# Altium schematic sheet interfaces.SchDoc
size C
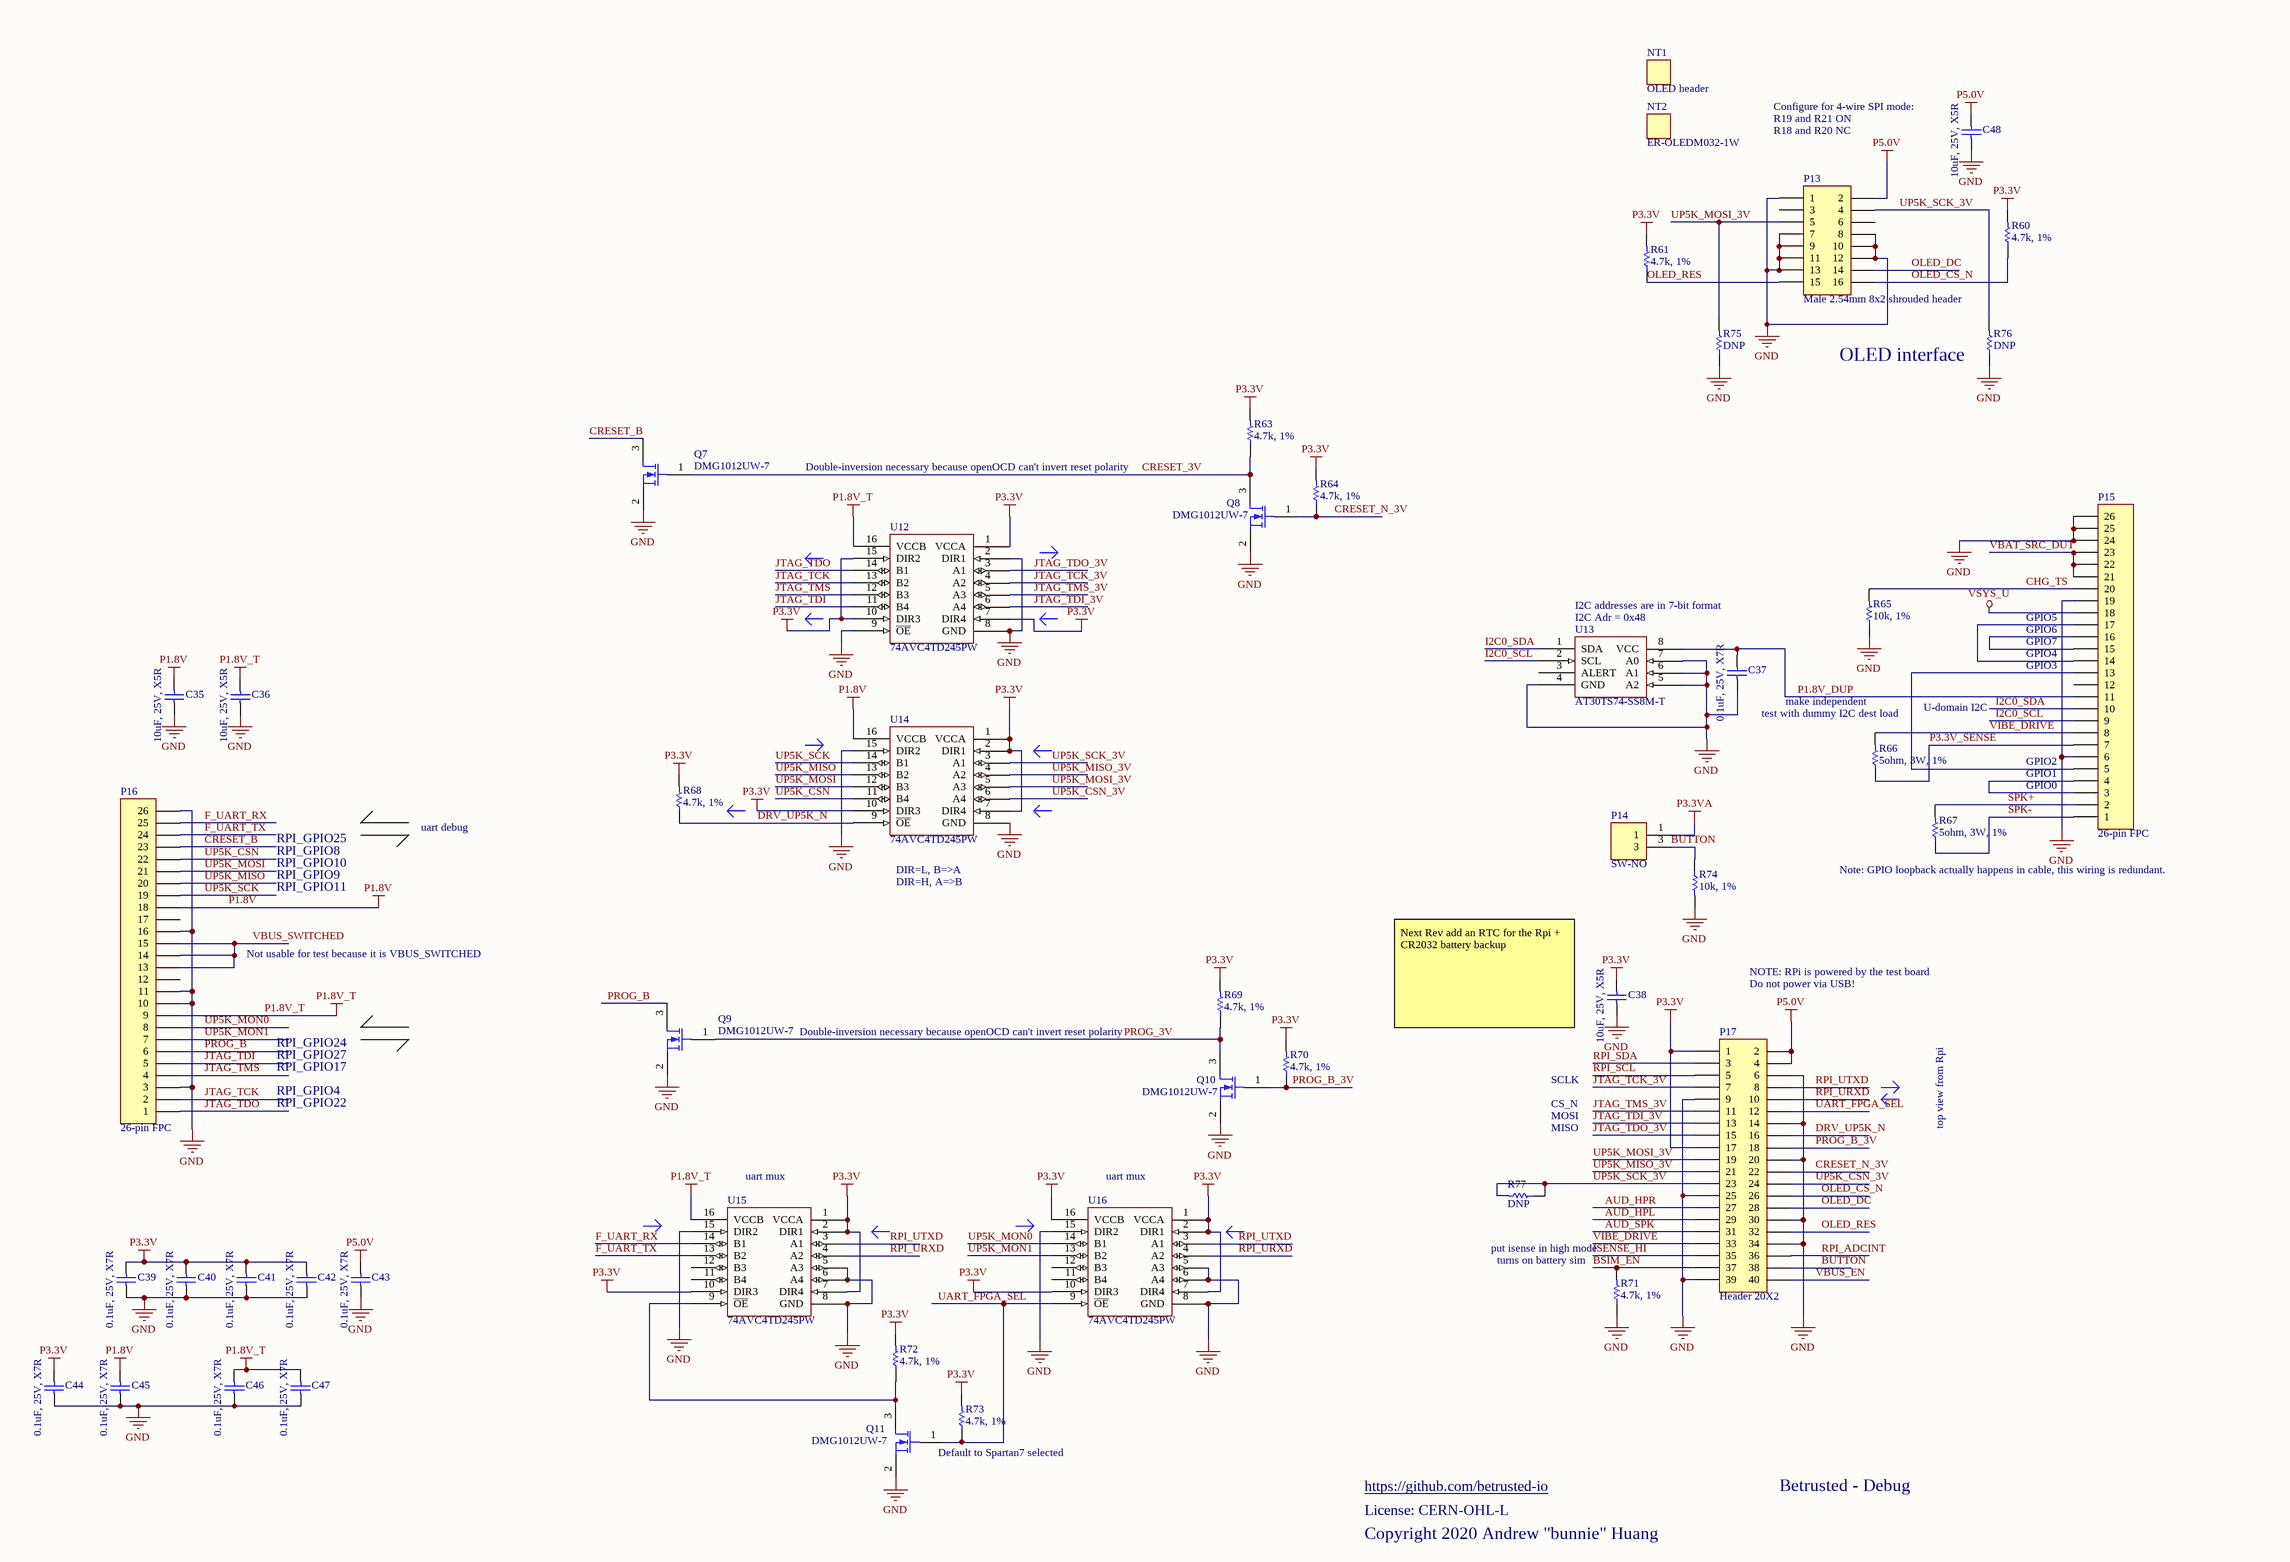
[diagram p0: interfaces.SchDoc]

## Parts
C35  10uF, 25V, X5R  [B_CAP0805]
C36  10uF, 25V, X5R  [B_CAP0805]
C37  0.1uF, 25V, X7R  [B_CAP0603]
C38  10uF, 25V, X5R  [B_CAP0805]
C39  0.1uF, 25V, X7R  [B_CAP0603]
C40  0.1uF, 25V, X7R  [B_CAP0603]
C41  0.1uF, 25V, X7R  [B_CAP0603]
C42  0.1uF, 25V, X7R  [B_CAP0603]
C43  0.1uF, 25V, X7R  [B_CAP0603]
C44  0.1uF, 25V, X7R  [B_CAP0603]
C45  0.1uF, 25V, X7R  [B_CAP0603]
C46  0.1uF, 25V, X7R  [B_CAP0603]
C47  0.1uF, 25V, X7R  [B_CAP0603]
C48  10uF, 25V, X5R  [B_CAP0805]
NT1  OLED header
NT2  ER-OLEDM032-1W
P13  Male 2.54mm 8x2 shrouded header  [ER_OLED_M032_1]
P14  SW-NO  [CK_KS11R22CQD]
P15  26-pin FPC  [HRS_FH34SRJ-26S-0.5SH(50)]
P16  26-pin FPC  [HRS_FH34SRJ-26S-0.5SH(50)]
P17  Header 20X2  [SAMTEC_SSW-120-01-F-D]
Q7  DMG1012UW-7  [SOT323-3AN]
Q8  DMG1012UW-7  [SOT323-3AN]
Q9  DMG1012UW-7  [SOT323-3AN]
Q10  DMG1012UW-7  [SOT323-3AN]
Q11  DMG1012UW-7  [SOT323-3AN]
R60  4.7k, 1%  [B_RES0603]
R61  4.7k, 1%  [B_RES0603]
R63  4.7k, 1%  [B_RES0603]
R64  4.7k, 1%  [B_RES0603]
R65  10k, 1%  [B_RES0603]
R66  5ohm, 3W, 1%  [OHMITE_43_3W]
R67  5ohm, 3W, 1%  [OHMITE_43_3W]
R68  4.7k, 1%  [B_RES0603]
R69  4.7k, 1%  [B_RES0603]
R70  4.7k, 1%  [B_RES0603]
R71  4.7k, 1%  [B_RES0603]
R72  4.7k, 1%  [B_RES0603]
R73  4.7k, 1%  [B_RES0603]
R74  10k, 1%  [B_RES0603]
R75  DNP  [B_RES0603]
R76  DNP  [B_RES0603]
R77  DNP  [B_RES0603]
U12  74AVC4TD245PW  [TSOP65P640-16AN]
U13  AT30TS74-SS8M-T  [SOIC127P600-8AN]
U14  74AVC4TD245PW  [TSOP65P640-16AN]
U15  74AVC4TD245PW  [TSOP65P640-16AN]
U16  74AVC4TD245PW  [TSOP65P640-16AN]

## Nets
GND: C35.2 C36.2 C37.2 C38.2 C39.2 C40.2 C41.2 C42.2 C43.2 C44.2 C45.2 C46.2 C47.2 C48.2 P13.1 P13.7 P13.8 P13.9 P13.10 P13.11 P13.12 P13.13 P15.6 P15.19 P15.24 P15.25 P15.26 P16.3 P16.10 P16.11 P16.16 P16.26 P17.6 P17.9 P17.14 P17.20 P17.25 P17.30 P17.34 P17.39 Q7.2(S) Q8.2(S) Q9.2(S) Q10.2(S) Q11.2(S) R65.1 R71.1 R74.2 R75.1 R76.1 U12.2(DIR1) U12.8(GND) U12.9(~{OE}) U13.4(GND) U13.5(A2) U13.6(A1) U13.7(A0) U14.8(GND) U14.15(DIR2) U15.5(A3) U15.6(A4) U15.8(GND) U15.15(DIR2) U16.5(A3) U16.6(A4) U16.8(GND) U16.15(DIR2)
P1.8V: C35.1 C45.1 P16.18 U14.16(VCCB)
P1.8V_T: C36.1 C46.1 C47.1 P16.9 U12.16(VCCB) U15.16(VCCB)
P3.3V: C38.1 C39.1 C40.1 C41.1 C42.1 C44.1 P17.1 P17.17 R60.2 R61.2 R63.2 R64.2 R68.2 R69.2 R70.2 R72.2 R73.2 U12.1(VCCA) U12.7(DIR4) U12.10(DIR3) U12.15(DIR2) U14.1(VCCA) U14.2(DIR1) U14.7(DIR4) U14.10(DIR3) U15.1(VCCA) U15.2(DIR1) U15.7(DIR4) U15.10(DIR3) U16.1(VCCA) U16.2(DIR1) U16.7(DIR4) U16.10(DIR3) U16.16(VCCB)
P3.3VA: P14.1
P5.0V: C43.1 C48.1 P13.2 P17.2 P17.4
VSYS_U: P15.18
AUD_HPL: P17.29
AUD_HPR: P17.27
AUD_SPK: P17.31
BSIM_EN: P17.37 R71.2
BUTTON: P14.3 P17.38 R74.1
CHG_TS: P15.20 R65.2
CRESET_3V: Q7.1(G) Q8.3(D) R63.1
CRESET_B: P16.23 Q7.3(D)
CRESET_N_3V: P17.22 Q8.1(G) R64.1
DRV_UP5K_N: P17.16 R68.1 U14.9(~{OE})
F_UART_RX: P16.25 U15.14(B1)
F_UART_TX: P16.24 U15.13(B2)
I2C0_SCL: P15.9 U13.2(SCL)
I2C0_SDA: P15.10 U13.1(SDA)
ISENSE_HI: P17.35
JTAG_TCK: P16.2 U12.13(B2)
JTAG_TCK_3V: P17.7 U12.4(A2)
JTAG_TDI: P16.5 U12.11(B4)
JTAG_TDI_3V: P17.13 U12.6(A4)
JTAG_TDO: P16.1 U12.14(B1)
JTAG_TDO_3V: P17.15 U12.3(A1)
JTAG_TMS: P16.4 U12.12(B3)
JTAG_TMS_3V: P17.11 U12.5(A3)
OLED_CS_N: P13.16 P17.26 R60.1
OLED_DC: P13.14 P17.28
OLED_RES: P13.15 P17.32 R61.1
P1.8V_DUP: C37.1 P15.11 U13.8(VCC)
P3.3V_SENSE: P15.7 R66.1
PROG_3V: Q9.1(G) Q10.3(D) R69.1
PROG_B: P16.6 Q9.3(D)
PROG_B_3V: P17.18 Q10.1(G) R70.1
RPI_ADCINT: P17.36
RPI_SCL: P17.5
RPI_SDA: P17.3
RPI_URXD: P17.10 U15.4(A2) U16.4(A2)
RPI_UTXD: P17.8 U15.3(A1) U16.3(A1)
SPK+: P15.2 R67.2
SPK-: P15.1 R67.1
UART_FPGA_SEL: P17.12 Q11.1(G) R73.1 U16.9(~{OE})
UP5K_CSN: P16.22 U14.11(B4)
UP5K_CSN_3V: P17.24 U14.6(A4)
UP5K_MISO: P16.20 U14.13(B2)
UP5K_MISO_3V: P17.21 U14.4(A2)
UP5K_MON0: P16.8 U16.14(B1)
UP5K_MON1: P16.7 U16.13(B2)
UP5K_MOSI: P16.21 U14.12(B3)
UP5K_MOSI_3V: P13.5 P17.19 R75.2 U14.5(A3)
UP5K_SCK: P16.19 U14.14(B1)
UP5K_SCK_3V: P13.4 P17.23 R76.2 R77.1 R77.2 U14.3(A1)
VBAT_SRC_DUT: P15.21 P15.22 P15.23
VBUS_EN: P17.40
VBUS_SWITCHED: P16.13 P16.14 P16.15
VIBE_DRIVE: P15.8 P17.33 R66.2
NetP15_3: P15.3 P15.4
NetP15_5: P15.5 P15.13
NetP15_14: P15.14 P15.17
NetP15_15: P15.15 P15.16
NetQ11_3: Q11.3(D) R72.1 U15.9(~{OE})

Not connected (* = marked no-connect by the designer): P13 3 6; P15 12; P16 12 17; U13 3(ALERT); U15 11(B4) 12(B3); U16 11(B4) 12(B3)

## Notes on the sheet
- (near C48) Configure for 4-wire SPI mode:
- R19 and R21 ON
- R18 and R20 NC
- (near R76) OLED interface
- Double-inversion necessary because openOCD can't invert reset polarity
- I2C addresses are in 7-bit format
- (near U13) I2C Adr = 0x48
- (near P15) GPIO4
- (near P15) GPIO5
- (near P15) GPIO6
- (near P15) GPIO7
- test with dummy I2C dest load
- make independent
- U-domain I2C
- (near P15) GPIO3
- (near P15) GPIO1
- (near P15) GPIO2
- uart debug
- (near P15) GPIO0
- RPI_GPIO10
- RPI_GPIO9
- RPI_GPIO11
- RPI_GPIO8
- RPI_GPIO25
- (near U14) DIR=L, B=>A
- DIR=H, A=>B
- (near R67) Note: GPIO loopback actually happens in cable, this wiring is redundant.
- Not usable for test because it is VBUS_SWITCHED
- (near C38) Next Rev add an RTC for the Rpi + CR2032 battery backup
- NOTE: RPi is powered by the test board
- Do not power via USB!
- RPI_GPIO17
- RPI_GPIO27
- RPI_GPIO24
- RPI_GPIO4
- RPI_GPIO22
- MOSI
- MISO
- SCLK
- CS_N
- top view from Rpi
- (near U15) uart mux
- (near U16) uart mux
- (near R71) put isense in high mode
- (near R71) turns on battery sim
- Default to Spartan7 selected
- https://github.com/betrusted-io
- Betrusted - Debug
- License: CERN-OHL-L
- Copyright 2020 Andrew "bunnie" Huang

## Library data of the parts
C35 C36 C38 C48 = Cap Semi: Capacitor (Semiconductor SIM Model); MPN: GRM21BR61E106KA73L; VENDOR: Murata; MYPN: C-106-25-X5R-0805
C37 C39-C47 = Cap Semi: Capacitor (Semiconductor SIM Model); MPN: CC0603KRX7R8BB104; VENDOR: Murata; MYPN: C-104-25-X7R-0603
NT1 = NOTE: Placeholder for non-board BOM items; MPN: PPPC082LFBN-RC; MYPN: NT-PPPC082LFBN-RC; VENDOR: Sullins
NT2 = NOTE: Placeholder for non-board BOM items; MYPN: NT-ER-OLEDM032-1W; VENDOR: East Rising; MPN: ER-OLEDM032-1W
P13 = Header 8X2: Header, 8-Pin, Dual row, shrouded; MPN: PRPC008DAAN-RC; MYPN: J-2.54MM-2x8-M-SHROUDED-RA; VENDOR: Sullins; LatestRevisionDate: 17-Jul-2002; LatestRevisionNote: Re-released for DXP Platform.; Publisher: Altium Limited
P14 = Header 2: Header, 2-Pin; LatestRevisionDate: 17-Jul-2002; LatestRevisionNote: Re-released for DXP Platform.; Publisher: Altium Limited
P15 = FPC-26: 26 Pin FPC header; MPN: FH34SRJ-26S-0.5SH(99); MYPN: J-FPC-0.5mm-26-0.3mm-T/B; VENDOR: Hirose; System: Connector
P16 = FPC-26: 26 Pin FPC header; MPN: FH34SRJ-26S-0.5SH(99); MYPN: J-FPC-0.5mm-26-0.3mm-T/B; VENDOR: Hirose
P17 = Header 20X2: Header, 20-Pin, Dual row; MPN: P-SSW-120-01-F-D; VENDOR: Samtec; LatestRevisionDate: 17-Jul-2002; LatestRevisionNote: Re-released for DXP Platform.; Publisher: Altium Limited
Q7-Q11 = MOSFET-N: N-Channel MOSFET; VENDOR: Diodes Inc; MYPN: Q-DMG1012UW-7; Published: 8-Jun-2000; LatestRevisionDate: 17-Jul-2002; LatestRevisionNote: Re-released for DXP Platform.; PackageVersion: 1995/1996; PackageReference: E3; Publisher: Altium Limited; MPN: DMG1012UW-7
R60 R61 R63 R64 R68-R73 = Res1: Resistor; MPN: RC0603FR-074K7L; VENDOR: Yageo; MYPN: R-472-1P-1_16W-0603
R65 R74 = Res1: Resistor; MPN: RC0603FR-0710KL; VENDOR: Yageo; MYPN: R-103-1P-1_16W-0603
R66 R67 = Res1: Resistor; MPN: 43F5R0E; VENDOR: Ohmite; MYPN: R-5R0-1P-3W-AXIAL15
R75-R77 = Res1: Resistor; VENDOR: ANY; MYPN: DNP; MPN: ANY
U12 U14-U16 = 74AVC4TD245: 4-bit dual supply translating transceiver with configurable voltage translation; 3-state; MYPN: U-74AVC4TD245PW; VENDOR: Nexperia; MPN: 74AVC4TD245PW
U13 = AT30TS74-SS8M-T: 9- to 12-bit Selectable, ±1.0°C Accurate Digital Temperature Sensor; MYPN: U-AT30TS74-SS8M-T; VENDOR: Atmel; MPN: AT30TS74-SS8M-T